# Altium schematic sheet Sensor Bar 2.0 RGB LED.SchDoc
size A4
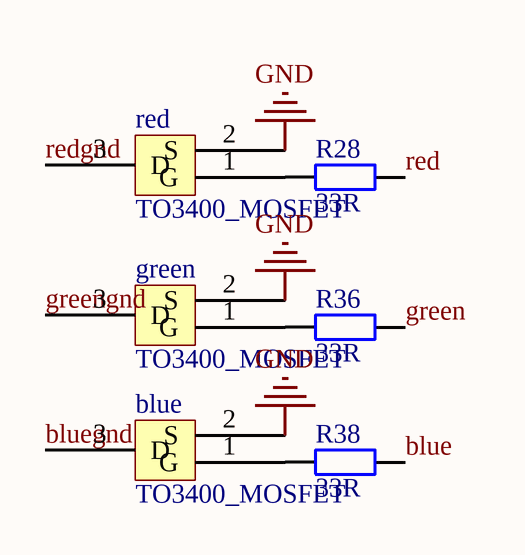
[diagram p0: Sensor Bar 2.0 RGB LED.SchDoc]

## Parts
blue  TO3400_MOSFET  [npn]
green  TO3400_MOSFET  [npn]
R28  33R  [CR2012-0805]
R36  33R  [CR2012-0805]
R38  33R  [CR2012-0805]
red  TO3400_MOSFET  [npn]

## Nets
GND: blue.2(S) green.2(S) red.2(S)
blue: R38.1
bluegnd: blue.3(D)
green: R36.1
greengnd: green.3(D)
red: R28.1
redgnd: red.3(D)
Netblue_1: blue.1(G) R38.2
Netgreen_1: green.1(G) R36.2
NetR28_2: R28.2 red.1(G)

## Library data of the parts
R28 R36 R38 = Res2: Resistor; Published: 8-Jun-2000; Revision: July-2002: Re-released for DXP Platform.; Publisher: Altium Limited